# Altium schematic sheet SCU_PCIe.SchDoc
size B
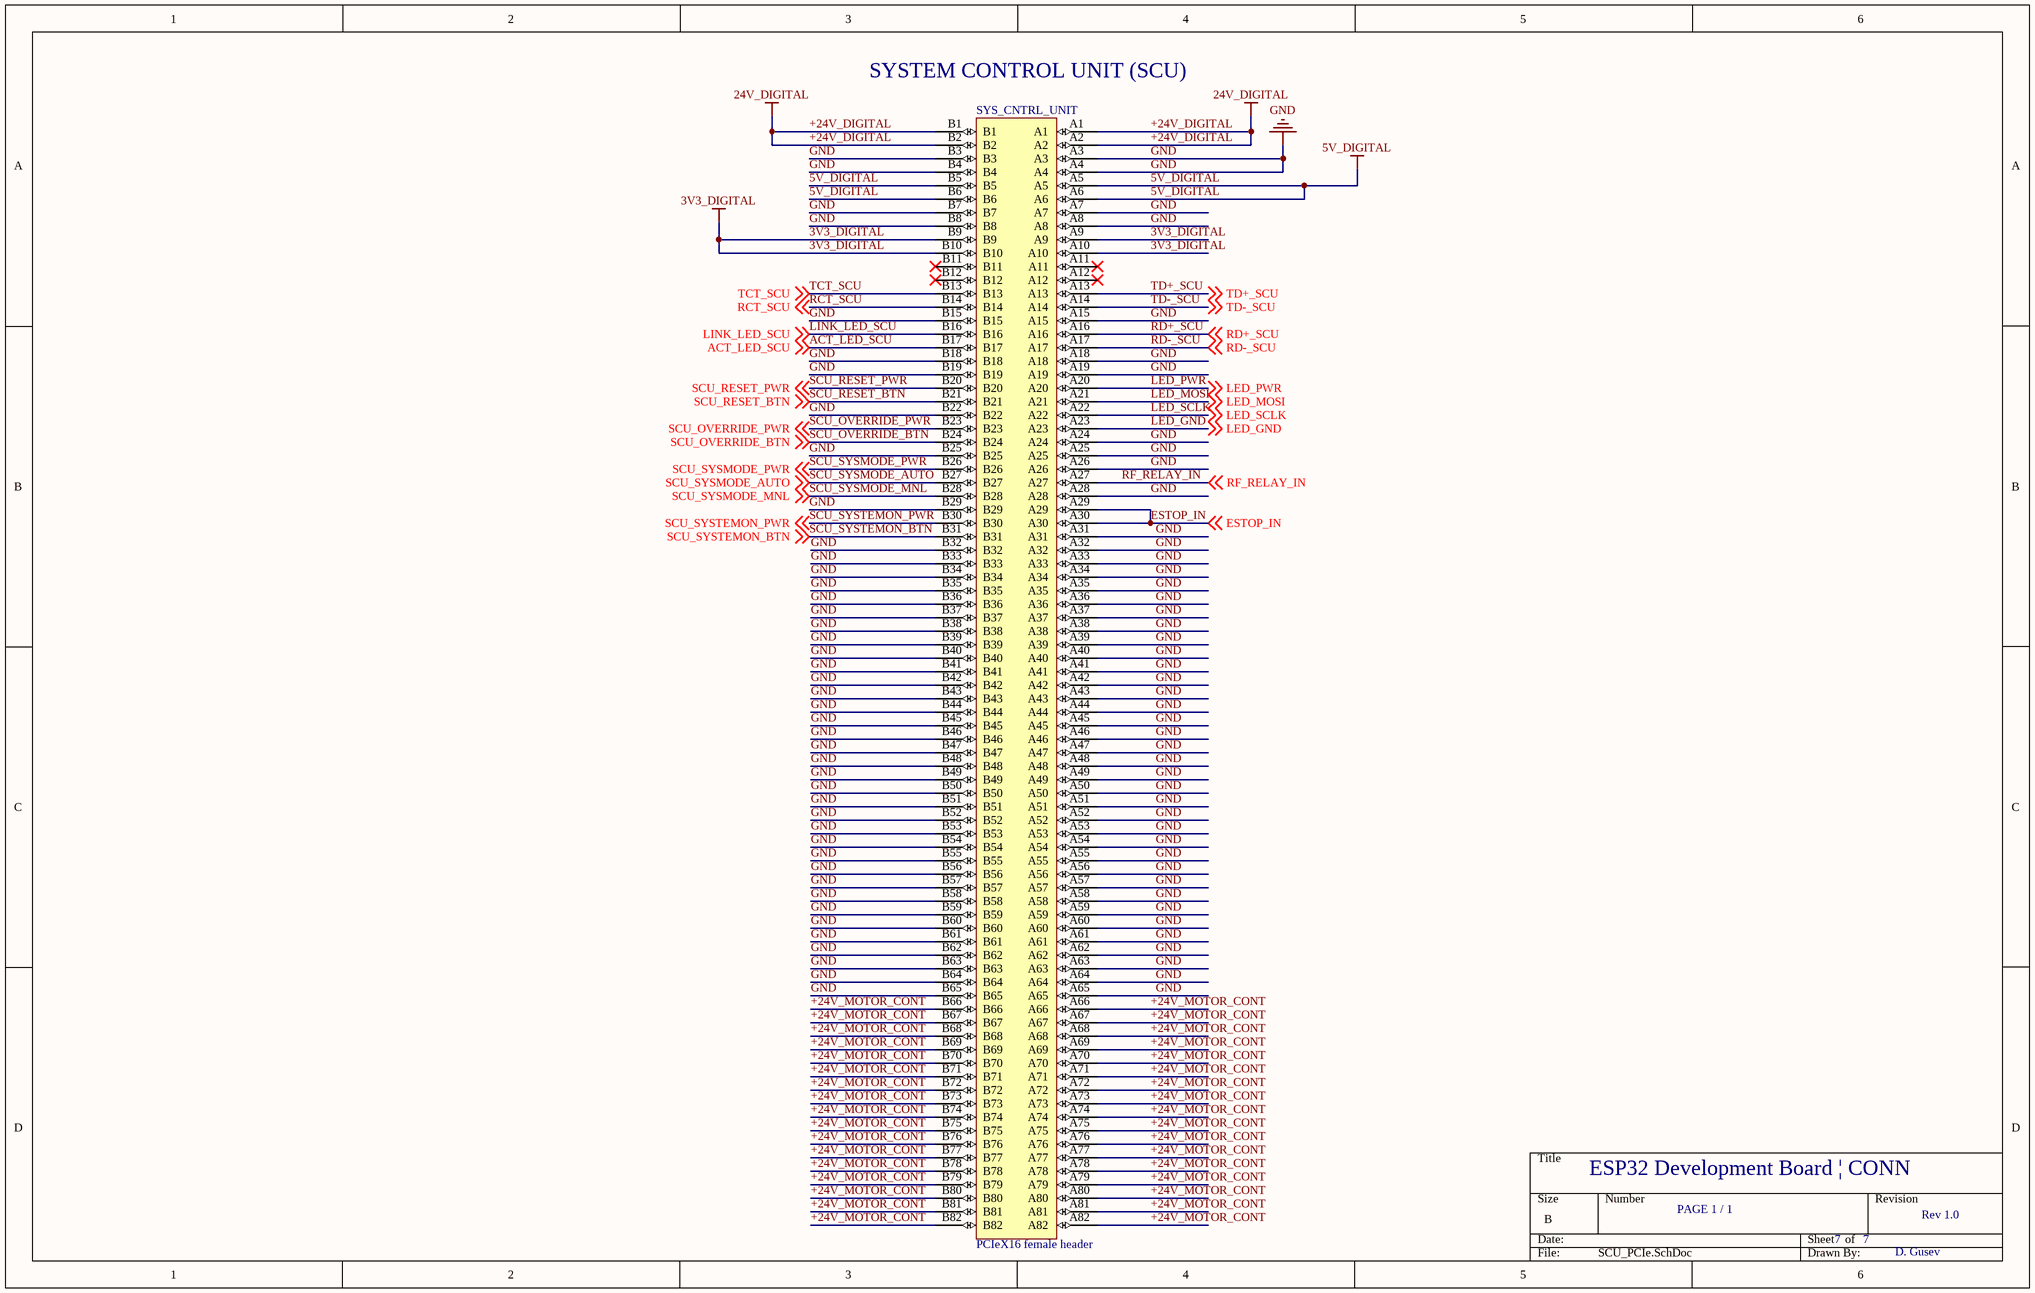
[diagram p0: SCU_PCIe.SchDoc]

## Parts
SYS_CNTRL_UNIT  PCIeX16 female header  [SAMTEC_PCIE-164-02-X-D-TH]

## Nets
3V3_DIGITAL: SYS_CNTRL_UNIT.A9 SYS_CNTRL_UNIT.A10 SYS_CNTRL_UNIT.B9 SYS_CNTRL_UNIT.B10
5V_DIGITAL: SYS_CNTRL_UNIT.A5 SYS_CNTRL_UNIT.A6 SYS_CNTRL_UNIT.B5 SYS_CNTRL_UNIT.B6
+24V_DIGITAL: SYS_CNTRL_UNIT.A1 SYS_CNTRL_UNIT.A2 SYS_CNTRL_UNIT.B1 SYS_CNTRL_UNIT.B2  [also labelled 24V_DIGITAL]
GND: SYS_CNTRL_UNIT.A3 SYS_CNTRL_UNIT.A4 SYS_CNTRL_UNIT.A7 SYS_CNTRL_UNIT.A8 SYS_CNTRL_UNIT.A15 SYS_CNTRL_UNIT.A18 SYS_CNTRL_UNIT.A19 SYS_CNTRL_UNIT.A24 SYS_CNTRL_UNIT.A25 SYS_CNTRL_UNIT.A26 SYS_CNTRL_UNIT.A28 SYS_CNTRL_UNIT.A31 SYS_CNTRL_UNIT.A32 SYS_CNTRL_UNIT.A33 SYS_CNTRL_UNIT.A34 SYS_CNTRL_UNIT.A35 SYS_CNTRL_UNIT.A36 SYS_CNTRL_UNIT.A37 SYS_CNTRL_UNIT.A38 SYS_CNTRL_UNIT.A39 SYS_CNTRL_UNIT.A40 SYS_CNTRL_UNIT.A41 SYS_CNTRL_UNIT.A42 SYS_CNTRL_UNIT.A43 SYS_CNTRL_UNIT.A44 SYS_CNTRL_UNIT.A45 SYS_CNTRL_UNIT.A46 SYS_CNTRL_UNIT.A47 SYS_CNTRL_UNIT.A48 SYS_CNTRL_UNIT.A49 SYS_CNTRL_UNIT.A50 SYS_CNTRL_UNIT.A51 SYS_CNTRL_UNIT.A52 SYS_CNTRL_UNIT.A53 SYS_CNTRL_UNIT.A54 SYS_CNTRL_UNIT.A55 SYS_CNTRL_UNIT.A56 SYS_CNTRL_UNIT.A57 SYS_CNTRL_UNIT.A58 SYS_CNTRL_UNIT.A59 SYS_CNTRL_UNIT.A60 SYS_CNTRL_UNIT.A61 SYS_CNTRL_UNIT.A62 SYS_CNTRL_UNIT.A63 SYS_CNTRL_UNIT.A64 SYS_CNTRL_UNIT.A65 SYS_CNTRL_UNIT.B3 SYS_CNTRL_UNIT.B4 SYS_CNTRL_UNIT.B7 SYS_CNTRL_UNIT.B8 SYS_CNTRL_UNIT.B15 SYS_CNTRL_UNIT.B18 SYS_CNTRL_UNIT.B19 SYS_CNTRL_UNIT.B22 SYS_CNTRL_UNIT.B25 SYS_CNTRL_UNIT.B29 SYS_CNTRL_UNIT.B32 SYS_CNTRL_UNIT.B33 SYS_CNTRL_UNIT.B34 SYS_CNTRL_UNIT.B35 SYS_CNTRL_UNIT.B36 SYS_CNTRL_UNIT.B37 SYS_CNTRL_UNIT.B38 SYS_CNTRL_UNIT.B39 SYS_CNTRL_UNIT.B40 SYS_CNTRL_UNIT.B41 SYS_CNTRL_UNIT.B42 SYS_CNTRL_UNIT.B43 SYS_CNTRL_UNIT.B44 SYS_CNTRL_UNIT.B45 SYS_CNTRL_UNIT.B46 SYS_CNTRL_UNIT.B47 SYS_CNTRL_UNIT.B48 SYS_CNTRL_UNIT.B49 SYS_CNTRL_UNIT.B50 SYS_CNTRL_UNIT.B51 SYS_CNTRL_UNIT.B52 SYS_CNTRL_UNIT.B53 SYS_CNTRL_UNIT.B54 SYS_CNTRL_UNIT.B55 SYS_CNTRL_UNIT.B56 SYS_CNTRL_UNIT.B57 SYS_CNTRL_UNIT.B58 SYS_CNTRL_UNIT.B59 SYS_CNTRL_UNIT.B60 SYS_CNTRL_UNIT.B61 SYS_CNTRL_UNIT.B62 SYS_CNTRL_UNIT.B63 SYS_CNTRL_UNIT.B64 SYS_CNTRL_UNIT.B65
+24V_MOTOR_CONT: SYS_CNTRL_UNIT.A66 SYS_CNTRL_UNIT.A67 SYS_CNTRL_UNIT.A68 SYS_CNTRL_UNIT.A69 SYS_CNTRL_UNIT.A70 SYS_CNTRL_UNIT.A71 SYS_CNTRL_UNIT.A72 SYS_CNTRL_UNIT.A73 SYS_CNTRL_UNIT.A74 SYS_CNTRL_UNIT.A75 SYS_CNTRL_UNIT.A76 SYS_CNTRL_UNIT.A77 SYS_CNTRL_UNIT.A78 SYS_CNTRL_UNIT.A79 SYS_CNTRL_UNIT.A80 SYS_CNTRL_UNIT.A81 SYS_CNTRL_UNIT.A82 SYS_CNTRL_UNIT.B66 SYS_CNTRL_UNIT.B67 SYS_CNTRL_UNIT.B68 SYS_CNTRL_UNIT.B69 SYS_CNTRL_UNIT.B70 SYS_CNTRL_UNIT.B71 SYS_CNTRL_UNIT.B72 SYS_CNTRL_UNIT.B73 SYS_CNTRL_UNIT.B74 SYS_CNTRL_UNIT.B75 SYS_CNTRL_UNIT.B76 SYS_CNTRL_UNIT.B77 SYS_CNTRL_UNIT.B78 SYS_CNTRL_UNIT.B79 SYS_CNTRL_UNIT.B80 SYS_CNTRL_UNIT.B81 SYS_CNTRL_UNIT.B82
ACT_LED_SCU: SYS_CNTRL_UNIT.B17 ; off-sheet ACT_LED_SCU
ESTOP_IN: SYS_CNTRL_UNIT.A29 SYS_CNTRL_UNIT.A30 ; off-sheet ESTOP_IN
LED_GND: SYS_CNTRL_UNIT.A23 ; off-sheet LED_GND
LED_MOSI: SYS_CNTRL_UNIT.A21 ; off-sheet LED_MOSI
LED_PWR: SYS_CNTRL_UNIT.A20 ; off-sheet LED_PWR
LED_SCLK: SYS_CNTRL_UNIT.A22 ; off-sheet LED_SCLK
LINK_LED_SCU: SYS_CNTRL_UNIT.B16 ; off-sheet LINK_LED_SCU
RCT_SCU: SYS_CNTRL_UNIT.B14 ; off-sheet RCT_SCU
RD+_SCU: SYS_CNTRL_UNIT.A16 ; off-sheet RD+_SCU
RD-_SCU: SYS_CNTRL_UNIT.A17 ; off-sheet RD-_SCU
RF_RELAY_IN: SYS_CNTRL_UNIT.A27 ; off-sheet RF_RELAY_IN
SCU_OVERRIDE_BTN: SYS_CNTRL_UNIT.B24 ; off-sheet SCU_OVERRIDE_BTN
SCU_OVERRIDE_PWR: SYS_CNTRL_UNIT.B23 ; off-sheet SCU_OVERRIDE_PWR
SCU_RESET_BTN: SYS_CNTRL_UNIT.B21 ; off-sheet SCU_RESET_BTN
SCU_RESET_PWR: SYS_CNTRL_UNIT.B20 ; off-sheet SCU_RESET_PWR
SCU_SYSMODE_AUTO: SYS_CNTRL_UNIT.B27 ; off-sheet SCU_SYSMODE_AUTO
SCU_SYSMODE_MNL: SYS_CNTRL_UNIT.B28 ; off-sheet SCU_SYSMODE_MNL
SCU_SYSMODE_PWR: SYS_CNTRL_UNIT.B26 ; off-sheet SCU_SYSMODE_PWR
SCU_SYSTEMON_BTN: SYS_CNTRL_UNIT.B31 ; off-sheet SCU_SYSTEMON_BTN
SCU_SYSTEMON_PWR: SYS_CNTRL_UNIT.B30 ; off-sheet SCU_SYSTEMON_PWR
TCT_SCU: SYS_CNTRL_UNIT.B13 ; off-sheet TCT_SCU
TD+_SCU: SYS_CNTRL_UNIT.A13 ; off-sheet TD+_SCU
TD-_SCU: SYS_CNTRL_UNIT.A14 ; off-sheet TD-_SCU

Not connected (* = marked no-connect by the designer): SYS_CNTRL_UNIT A11* A12* B11* B12*

## Notes on the sheet
- (near SYS_CNTRL_UNIT) SYSTEM CONTROL UNIT (SCU)
- ESP32 Development Board | CONN
- PAGE 1 / 1
- 7
- Rev 1.0
- D. Gusev

## Library data of the parts
SYS_CNTRL_UNIT = PCIeX16 female header: 164-position SAMTEC female header